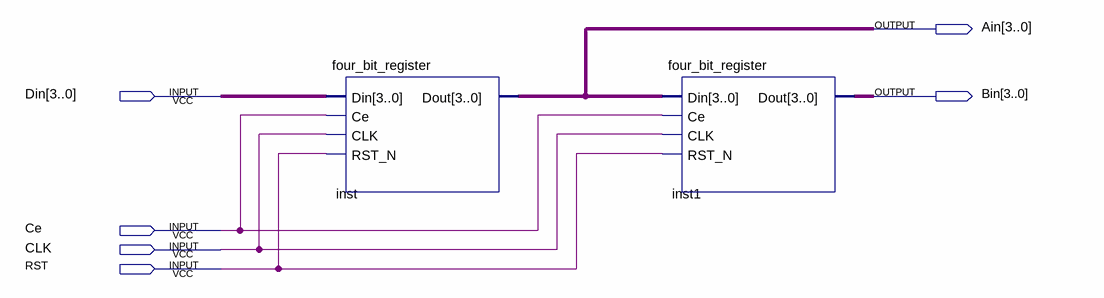
[diagram p0: schematic sheet]
// Quartus schematic DoubleFourBitsRegister.bdf as structural Verilog: 2 symbols, 6 pins
module DoubleFourBitsRegister (
  input  [3:0] Din,
  input  Ce,
  input  CLK,
  input  RST,
  output [3:0] Ain,
  output [3:0] Bin
);

  four_bit_register inst (.Din(Din), .Ce(Ce), .CLK(CLK), .RST_N(RST), .Dout(Ain));
  four_bit_register inst1 (.Din(Ain), .Ce(Ce), .CLK(CLK), .RST_N(RST), .Dout(Bin));
endmodule
